# Altium schematic sheet BatteryCharge.SchDoc
size A4
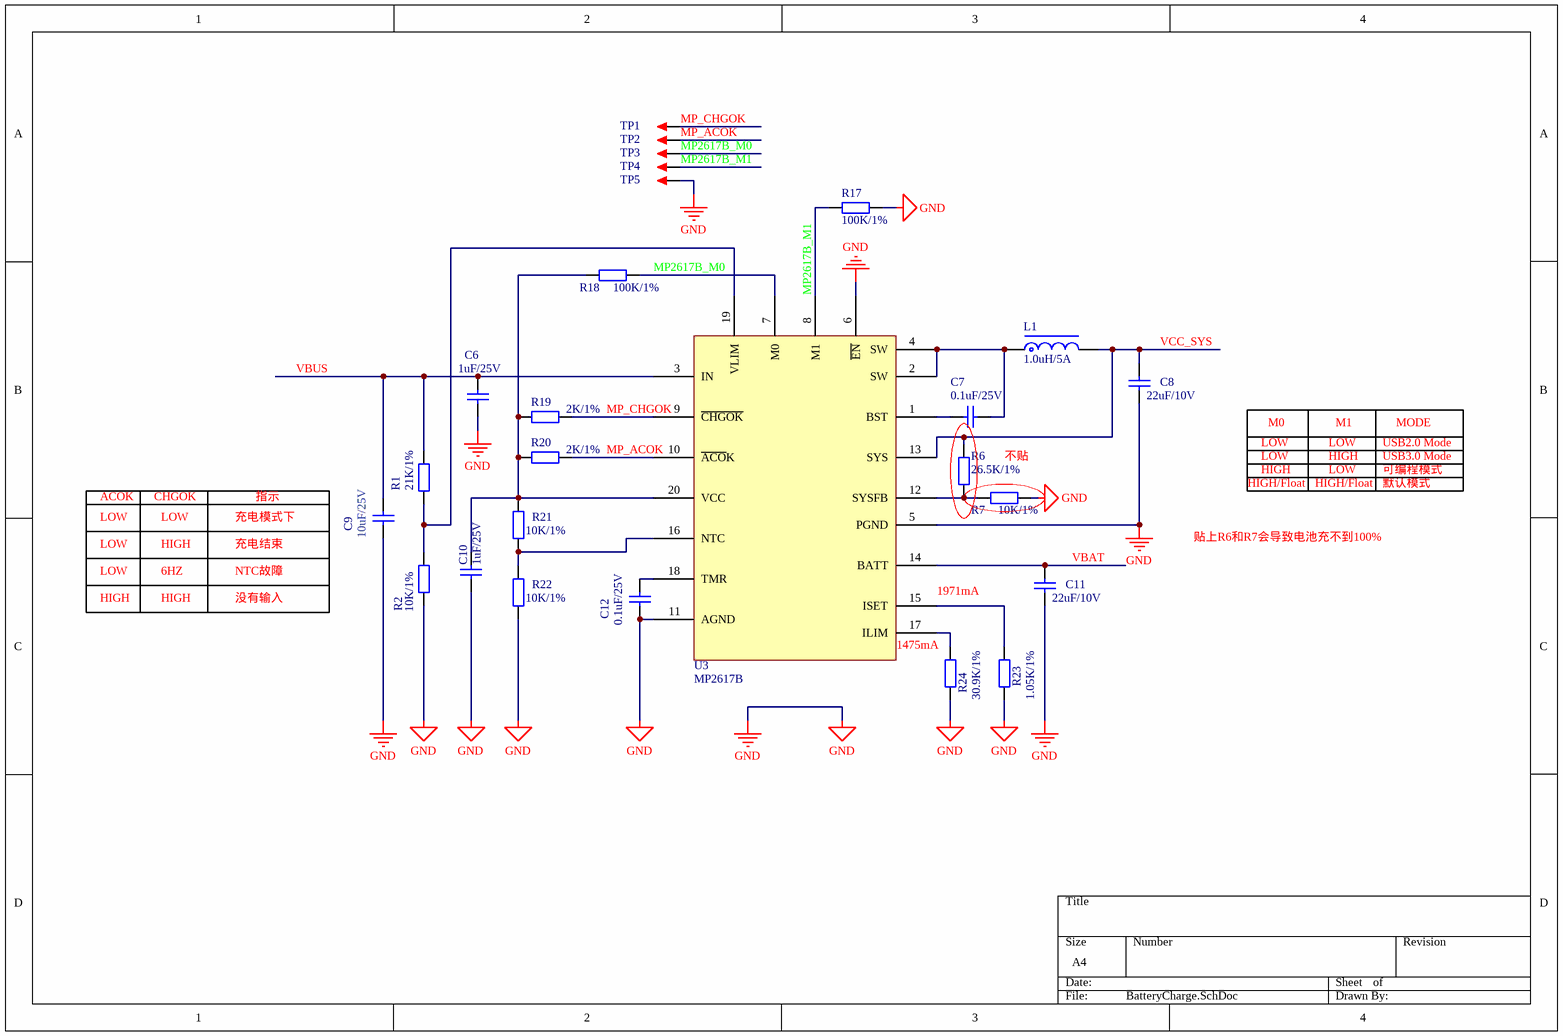
[diagram p0: BatteryCharge.SchDoc]

## Parts
C6  1uF/25V  [C0402_L]
C7  0.1uF/25V  [C0402_L]
C8  22uF/10V  [C0603_L]
C9  10uF/25V  [C0603_L]
C10  1uF/25V  [C0402_L]
C11  22uF/10V  [C0603_L]
C12  0.1uF/25V  [C0402_L]
L1  1.0uH/5A  [L-SMD-0630]
R1  21K/1%  [R0402_L]
R2  10K/1%  [R0402_L]
R6  26.5K/1%  [R0402_L]
R7  10K/1%  [R0402_L]
R17  100K/1%  [R0402_L]
R18  100K/1%  [R0402_L]
R19  2K/1%  [R0402_L]
R20  2K/1%  [R0402_L]
R21  10K/1%  [R0402_L]
R22  10K/1%  [R0402_L]
R23  1.05K/1%  [R0402_L]
R24  30.9K/1%  [R0402_L]
TP1  TEST  [TEST 1]  (value not drawn)
TP2  TEST  [TEST 1]  (value not drawn)
TP3  TEST  [TEST 1]  (value not drawn)
TP4  TEST  [TEST 1]  (value not drawn)
TP5  TEST  [TEST 1]  (value not drawn)
U3  MP2617B  [QFN-20]

## Nets
GND: C6.1 C8.1 C9.1 C10.1 C11.1 C12.2 R2.1 R7.2 R17.2 R22.1 R23.1 R24.1 TP5.1 U3.5(PGND) U3.6(~{EN}) U3.11(AGND)
MP2617B_M0: R18.2 TP3.1 U3.7(M0)
MP2617B_M1: R17.1 TP4.1 U3.8(M1)
MP_ACOK: R20.2 TP2.1 U3.10(~{ACO}K)
MP_CHGOK: R19.2 TP1.1 U3.9(~{CHGOK})
VBAT: C11.2 U3.14(BATT)
VBUS: C6.2 C9.2 R1.2 U3.3(IN)
VCC_SYS: C8.2 L1.2 R6.2 U3.13(SYS)
NetC7_1: C7.1 L1.1 U3.2(SW) U3.4(SW)
NetC7_2: C7.2 U3.1(BST)
NetC10_2: C10.2 R18.1 R19.1 R20.1 R21.2 U3.20(VCC)
NetC12_1: C12.1 U3.18(TMR)
NetR1_1: R1.1 R2.2 U3.19(VLIM)
NetR6_1: R6.1 R7.1 U3.12(SYSFB)
NetR21_1: R21.1 R22.2 U3.16(NTC)
NetR23_2: R23.2 U3.15(ISET)
NetR24_2: R24.2 U3.17(ILIM)

## Notes on the sheet
- LOW
- M0
- M1
- USB2.0 Mode
- MODE
- ACOK
- CHGOK
- 充电模式下
- 指示
- 不贴
- HIGH/Float
- HIGH
- USB3.0 Mode
- 可编程模式
- 默认模式
- 6HZ
- 充电结束
- NTC故障
- 贴上R6和R7会导致电池充不到100%
- 没有输入
- (near U3) 1475mA
- 1971mA

## Library data of the parts
C6-C12 = C: 贴片电容; BOM名称: 无极性贴片电容; 联系卖家，免费查找封装: 唯一出售店铺网址https://shop463601444.taobao.com
L1 = L-CDRH: CDRH功率屏蔽电感; BOM名称: 功率屏蔽电感; 联系卖家，免费查找封装: 唯一出售店铺网址https://shop463601444.taobao.com
R1 R2 R6 R7 R17-R24 = R: 贴片电阻; 联系卖家，免费查找封装: 唯一出售店铺网址https://shop463601444.taobao.com; BOM名称: 贴片电阻
TP1-TP5 = TEST: 测试点; 联系卖家，免费查找封装: 唯一出售店铺网址https://shop463601444.taobao.com; 封装库来自淘宝卖家ID：黄晶宝石: 其他店铺购入均为盗版假冒封装库，请立即申请退款; BOM名称: 测试点
U3 = MP2617B: 锂电池充电IC，电源路径管理